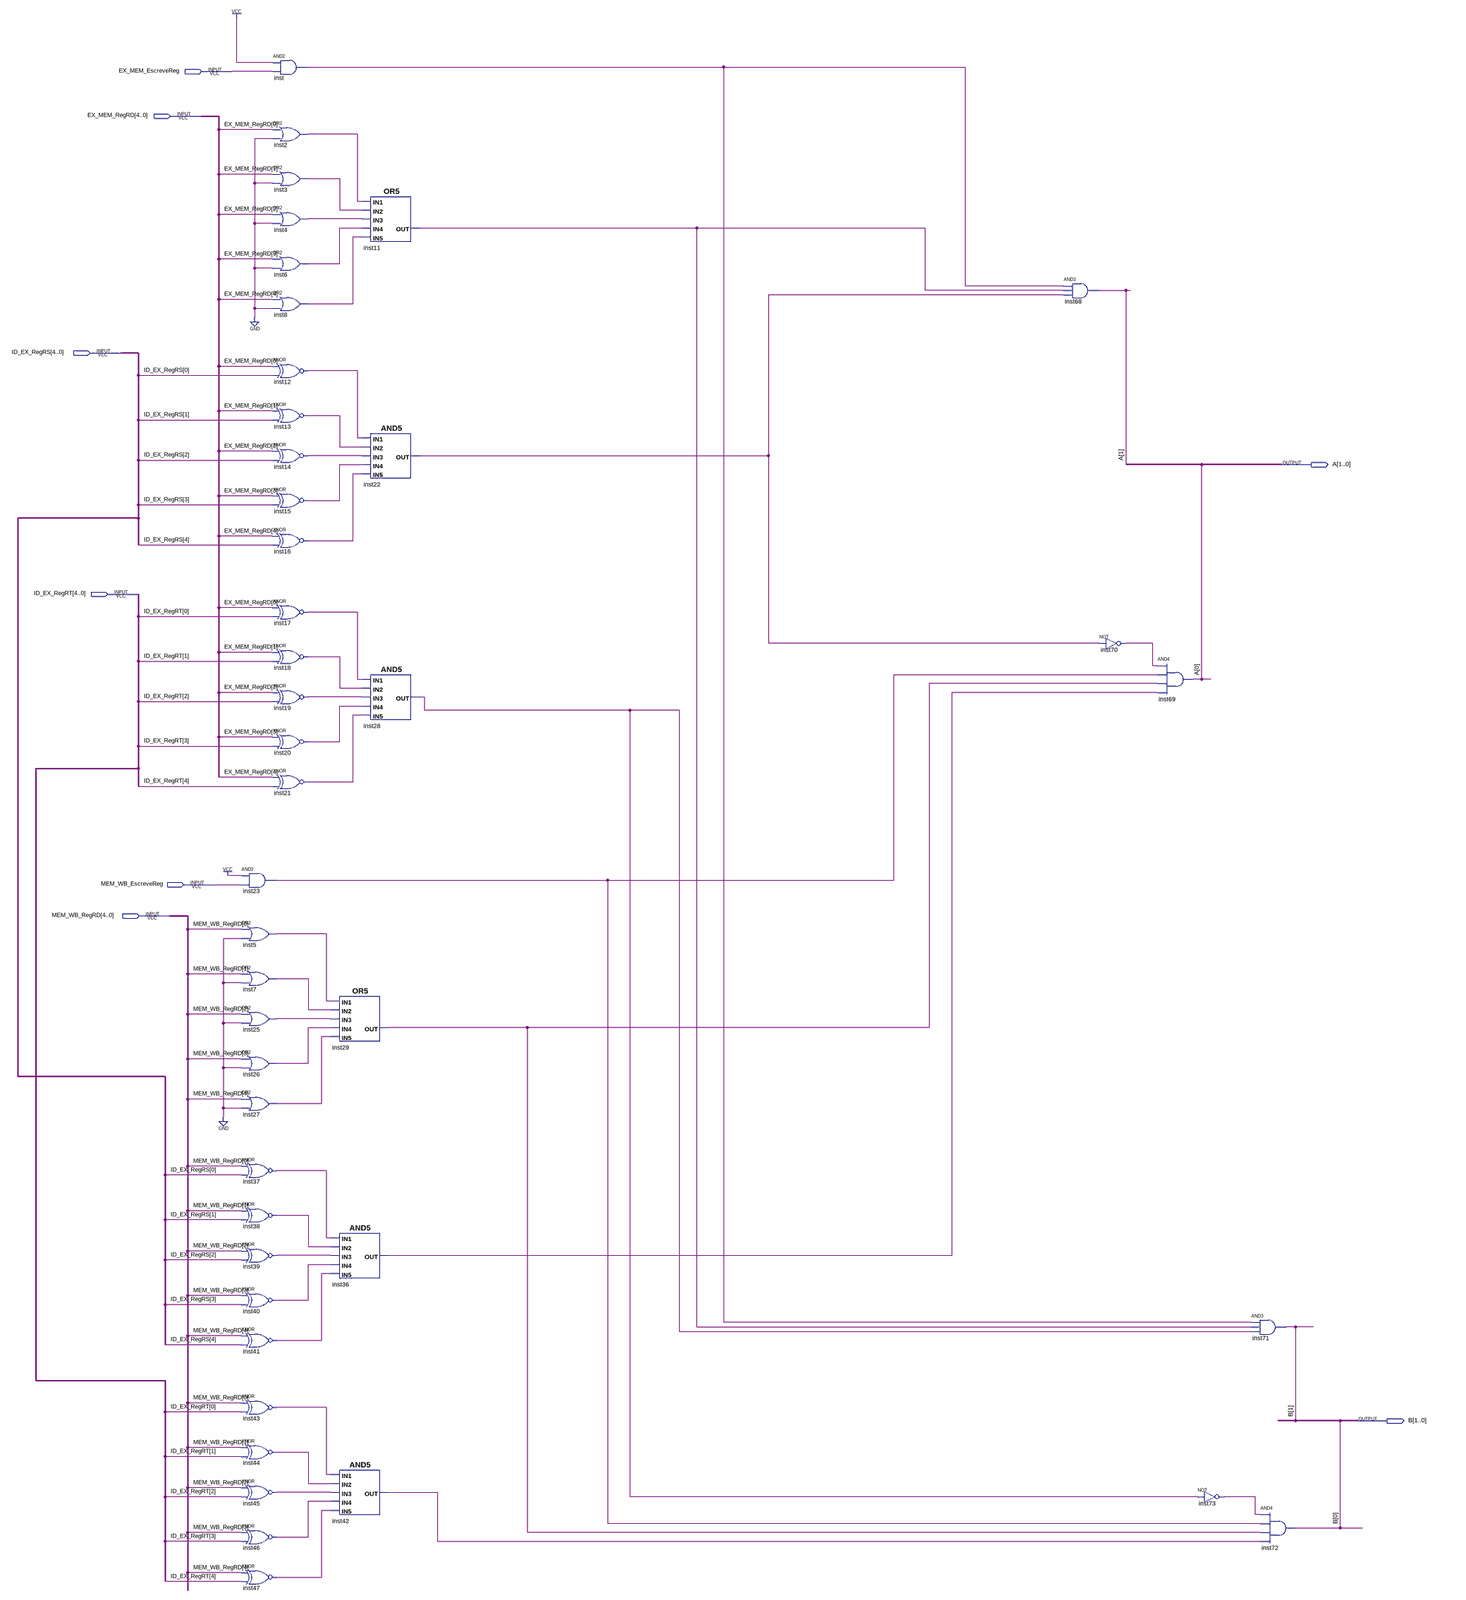
[diagram p0: schematic sheet, whole]
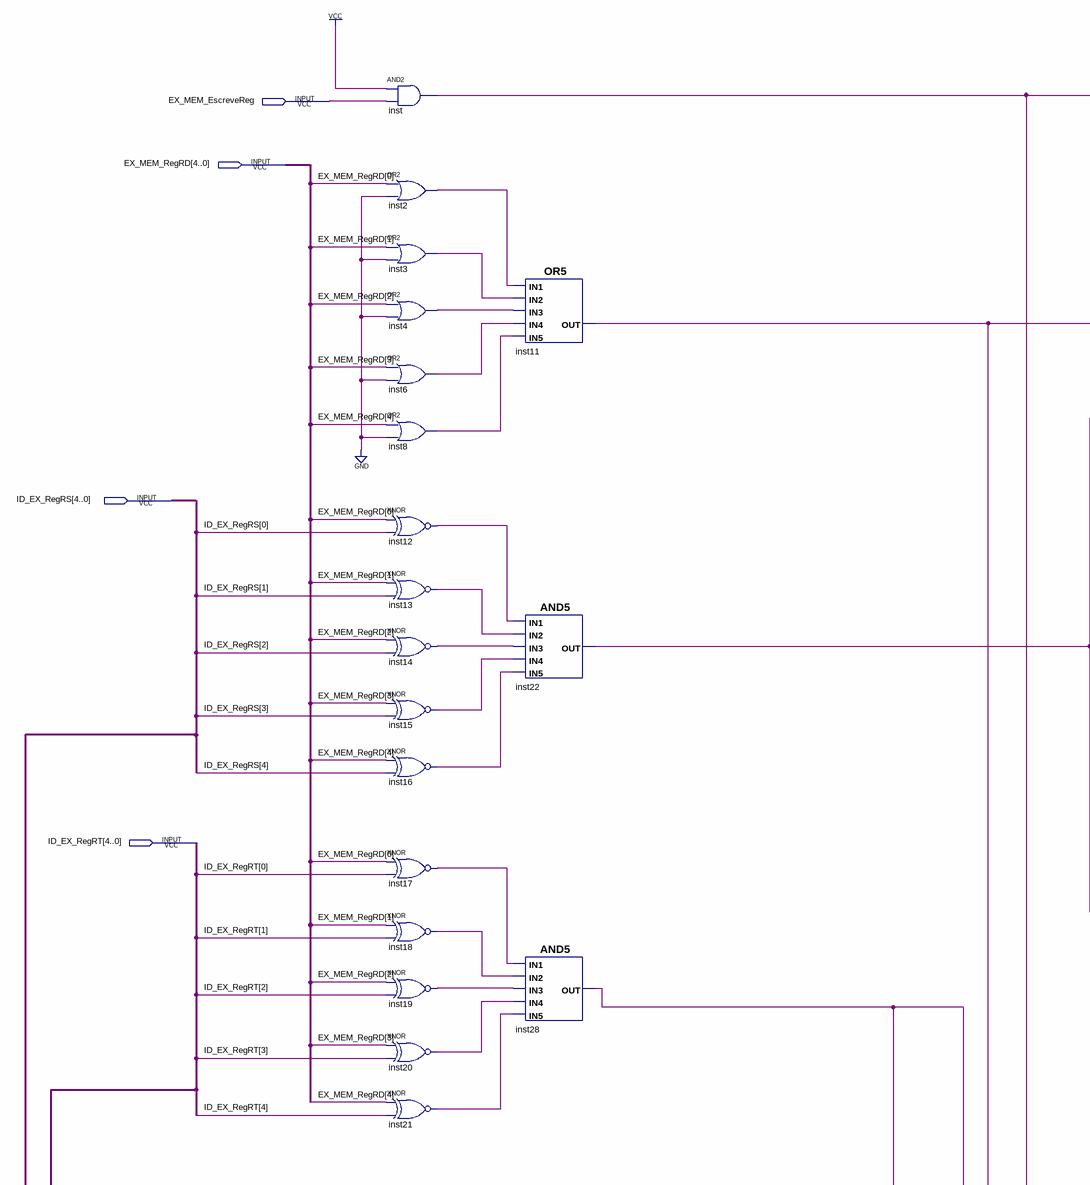
[diagram p1: schematic sheet, upper left part]
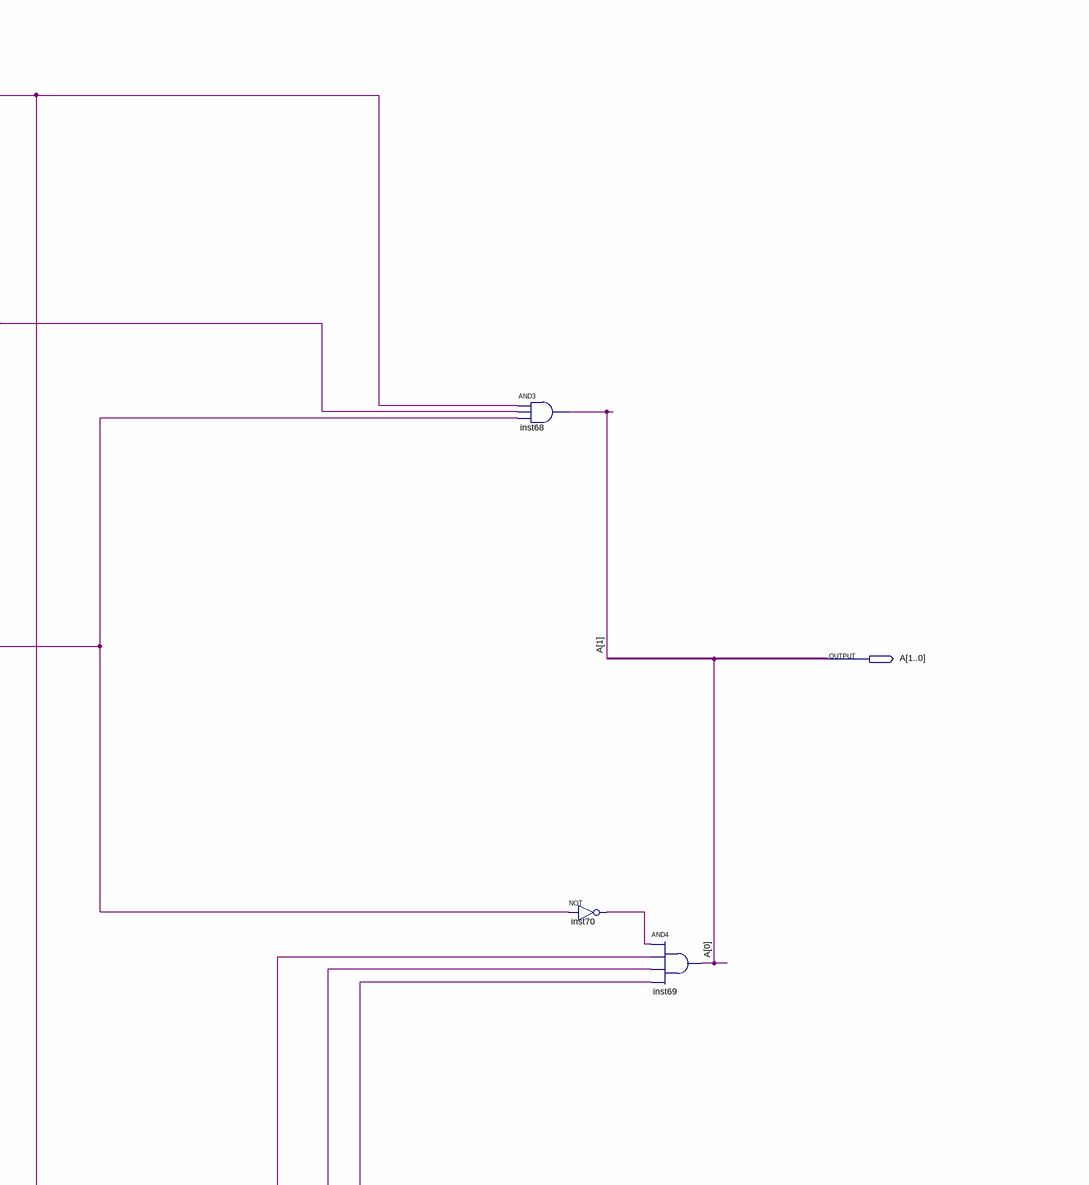
[diagram p2: schematic sheet, upper right part]
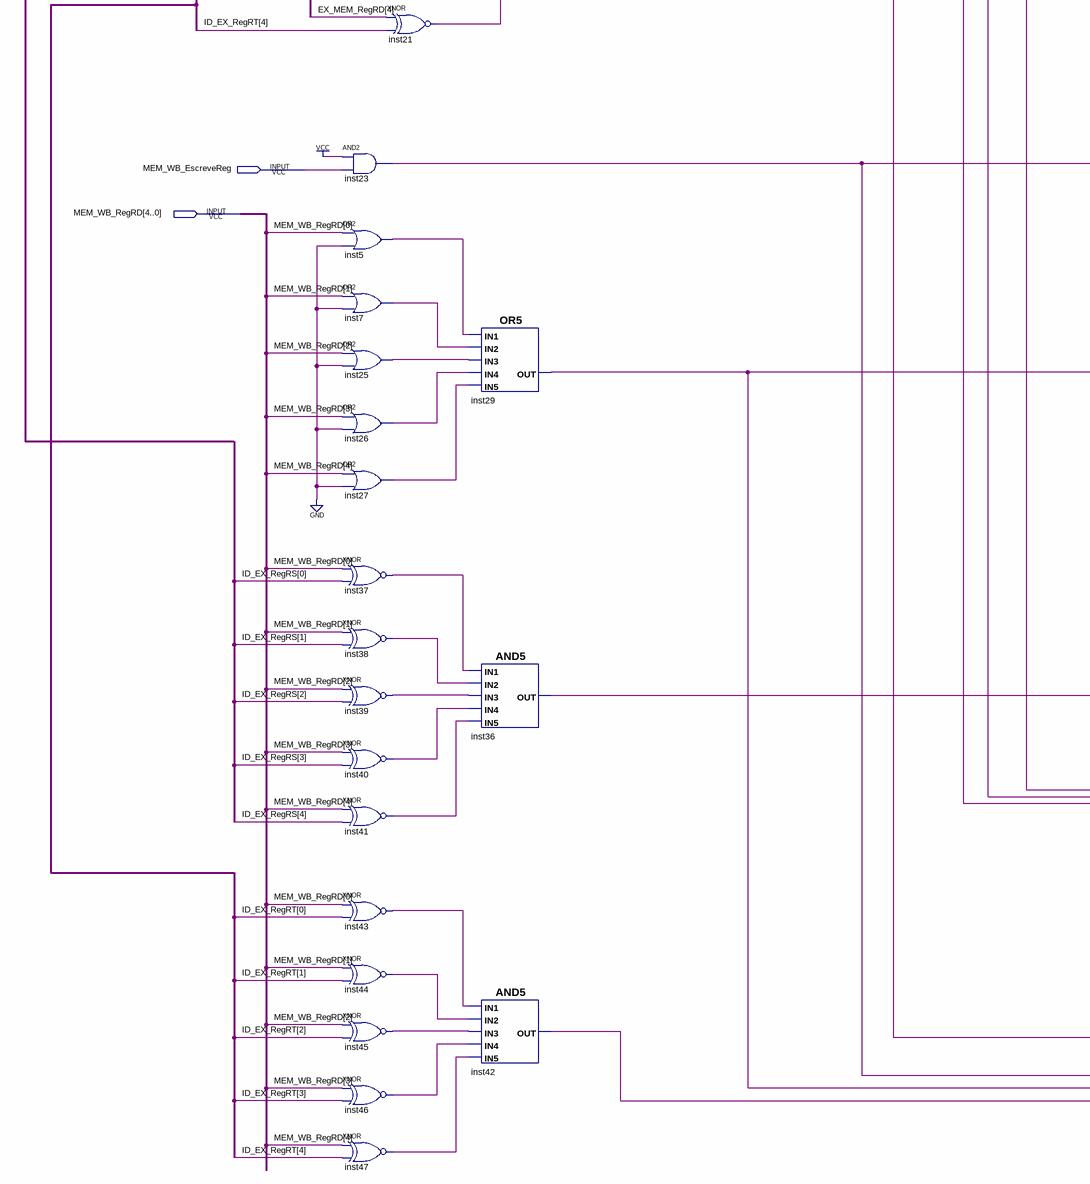
[diagram p3: schematic sheet, lower left part]
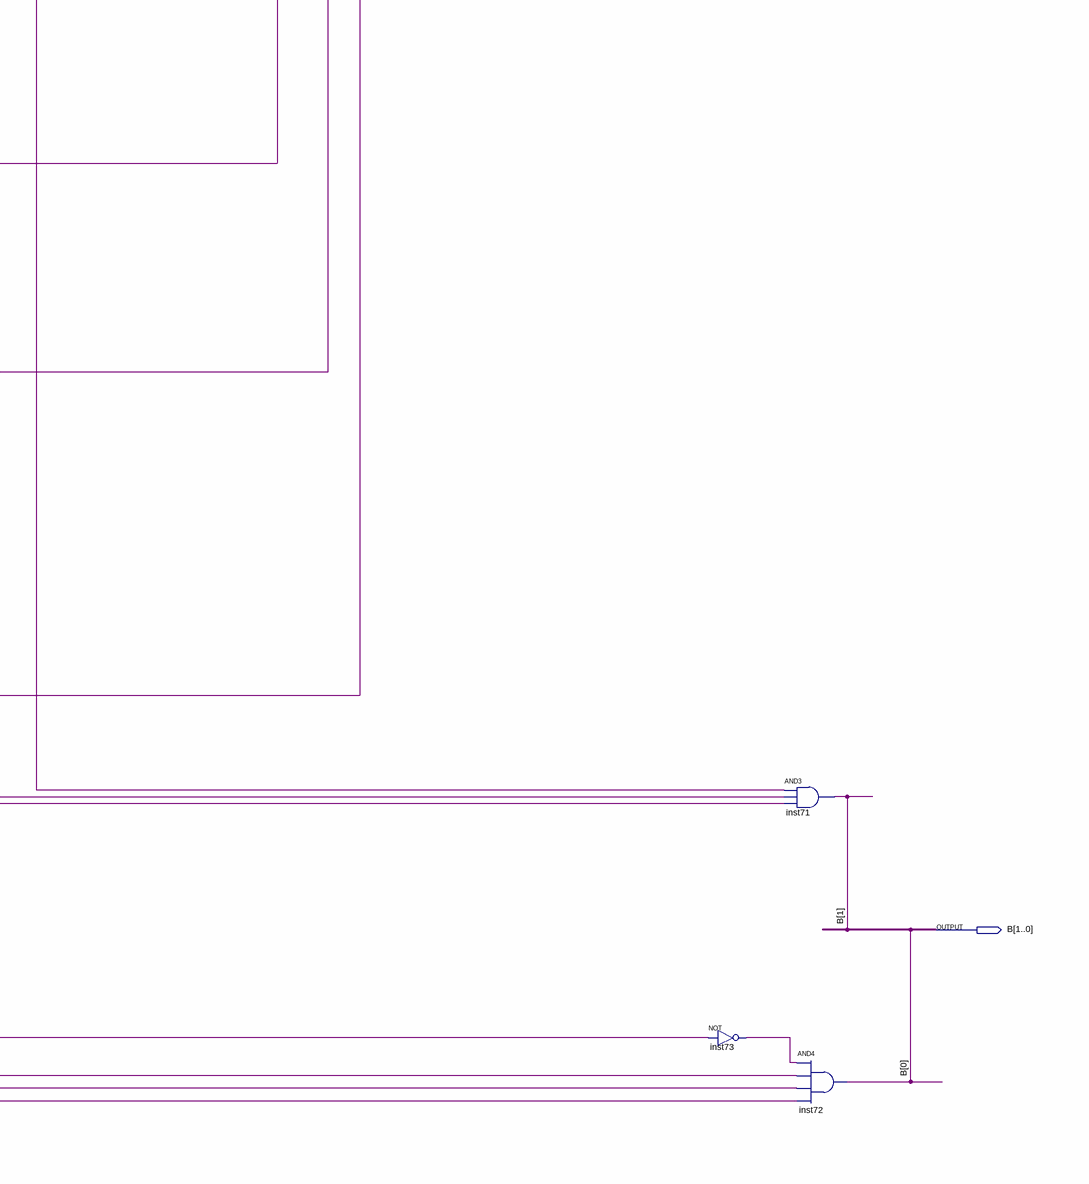
[diagram p4: schematic sheet, lower right part]
// Quartus schematic UNI_FORW.bdf as structural Verilog: 44 symbols, 8 pins
module UNI_FORW (
  input  EX_MEM_EscreveReg,
  input  [4:0] EX_MEM_RegRD,
  input  [4:0] ID_EX_RegRS,
  input  [4:0] ID_EX_RegRT,
  input  MEM_WB_EscreveReg,
  input  [4:0] MEM_WB_RegRD,
  output [1:0] A,
  output [1:0] B
);

  wire inst2_out, inst3_out, inst4_out, inst5_out, inst6_out, inst7_out, inst8_out, inst11_out, inst12_out,
       inst13_out, inst14_out, inst15_out, inst16_out, inst17_out, inst18_out, inst19_out, inst20_out,
       inst21_out, inst22_out, inst23_out, inst25_out, inst26_out, inst27_out, inst28_out, inst29_out,
       inst36_out, inst37_out, inst38_out, inst39_out, inst40_out, inst41_out, inst42_out, inst43_out,
       inst44_out, inst45_out, inst46_out, inst47_out, inst70_out, inst73_out, inst_out;

  and inst23 (inst23_out, 1'b1, MEM_WB_EscreveReg);
  or inst5 (inst5_out, MEM_WB_RegRD[0], 1'b0);
  or inst7 (inst7_out, MEM_WB_RegRD[1], 1'b0);
  or inst25 (inst25_out, MEM_WB_RegRD[2], 1'b0);
  or inst26 (inst26_out, MEM_WB_RegRD[3], 1'b0);
  or inst27 (inst27_out, MEM_WB_RegRD[4], 1'b0);
  xnor inst37 (inst37_out, MEM_WB_RegRD[0], ID_EX_RegRS[0]);
  xnor inst38 (inst38_out, MEM_WB_RegRD[1], ID_EX_RegRS[1]);
  xnor inst39 (inst39_out, MEM_WB_RegRD[2], ID_EX_RegRS[2]);
  xnor inst40 (inst40_out, MEM_WB_RegRD[3], ID_EX_RegRS[3]);
  xnor inst41 (inst41_out, MEM_WB_RegRD[4], ID_EX_RegRS[4]);
  xnor inst43 (inst43_out, MEM_WB_RegRD[0], ID_EX_RegRT[0]);
  xnor inst44 (inst44_out, MEM_WB_RegRD[1], ID_EX_RegRT[1]);
  xnor inst45 (inst45_out, MEM_WB_RegRD[2], ID_EX_RegRT[2]);
  xnor inst46 (inst46_out, MEM_WB_RegRD[3], ID_EX_RegRT[3]);
  xnor inst47 (inst47_out, MEM_WB_RegRD[4], ID_EX_RegRT[4]);
  and inst (inst_out, 1'b1, EX_MEM_EscreveReg);
  or inst2 (inst2_out, EX_MEM_RegRD[0], 1'b0);
  or inst3 (inst3_out, EX_MEM_RegRD[1], 1'b0);
  or inst4 (inst4_out, EX_MEM_RegRD[2], 1'b0);
  or inst6 (inst6_out, EX_MEM_RegRD[3], 1'b0);
  or inst8 (inst8_out, EX_MEM_RegRD[4], 1'b0);
  xnor inst12 (inst12_out, EX_MEM_RegRD[0], ID_EX_RegRS[0]);
  xnor inst13 (inst13_out, EX_MEM_RegRD[1], ID_EX_RegRS[1]);
  xnor inst14 (inst14_out, EX_MEM_RegRD[2], ID_EX_RegRS[2]);
  xnor inst15 (inst15_out, EX_MEM_RegRD[3], ID_EX_RegRS[3]);
  xnor inst16 (inst16_out, EX_MEM_RegRD[4], ID_EX_RegRS[4]);
  xnor inst17 (inst17_out, EX_MEM_RegRD[0], ID_EX_RegRT[0]);
  xnor inst18 (inst18_out, EX_MEM_RegRD[1], ID_EX_RegRT[1]);
  xnor inst19 (inst19_out, EX_MEM_RegRD[2], ID_EX_RegRT[2]);
  xnor inst20 (inst20_out, EX_MEM_RegRD[3], ID_EX_RegRT[3]);
  xnor inst21 (inst21_out, EX_MEM_RegRD[4], ID_EX_RegRT[4]);
  or inst29 (inst29_out, inst5_out, inst7_out, inst25_out, inst26_out, inst27_out);
  and inst36 (inst36_out, inst37_out, inst38_out, inst39_out, inst40_out, inst41_out);
  and inst42 (inst42_out, inst43_out, inst44_out, inst45_out, inst46_out, inst47_out);
  or inst11 (inst11_out, inst2_out, inst3_out, inst4_out, inst6_out, inst8_out);
  and inst22 (inst22_out, inst12_out, inst13_out, inst14_out, inst15_out, inst16_out);
  and inst28 (inst28_out, inst17_out, inst18_out, inst19_out, inst20_out, inst21_out);
  and inst68 (A[1], inst_out, inst11_out, inst22_out);
  not inst70 (inst70_out, inst22_out);
  and inst69 (A[0], inst70_out, inst23_out, inst29_out, inst36_out);
  not inst73 (inst73_out, inst28_out);
  and inst71 (B[1], inst_out, inst11_out, inst28_out);
  and inst72 (B[0], inst73_out, inst23_out, inst29_out, inst42_out);
endmodule
